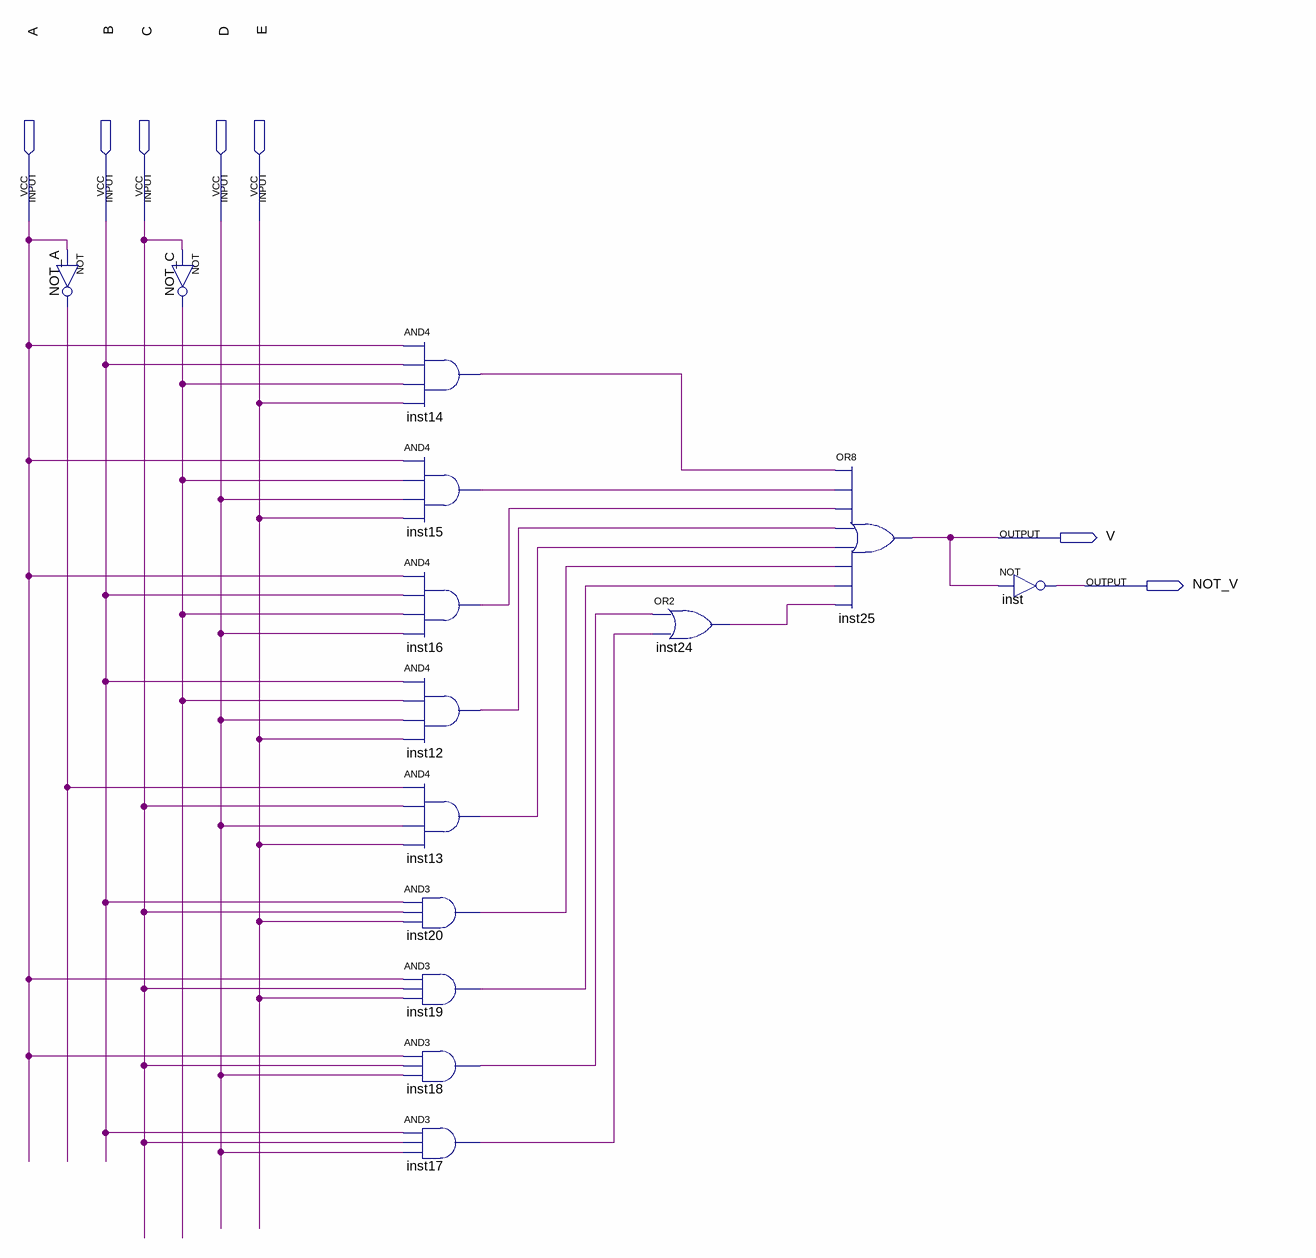
[diagram p0: schematic sheet]
// Quartus schematic devoir1_c1.bdf as structural Verilog: 14 symbols, 7 pins
module devoir1_c1 (
  input  A,
  input  B,
  input  C,
  input  D,
  input  E,
  output V,
  output NOT_V
);

  wire inst12_out, inst13_out, inst14_out, inst15_out, inst16_out, inst17_out, inst18_out, inst19_out,
       inst20_out, inst24_out, NOT_A_out, NOT_C_out;

  not NOT_A (NOT_A_out, A);
  not NOT_C (NOT_C_out, C);
  and inst14 (inst14_out, A, B, NOT_C_out, E);
  and inst15 (inst15_out, A, NOT_C_out, D, E);
  and inst16 (inst16_out, A, B, NOT_C_out, D);
  and inst12 (inst12_out, B, NOT_C_out, D, E);
  and inst13 (inst13_out, NOT_A_out, C, D, E);
  and inst20 (inst20_out, B, C, E);
  and inst19 (inst19_out, A, C, E);
  and inst18 (inst18_out, A, C, D);
  and inst17 (inst17_out, B, C, D);
  or inst24 (inst24_out, inst18_out, inst17_out);
  or inst25 (V, inst14_out, inst15_out, inst16_out, inst12_out, inst13_out, inst20_out, inst19_out, inst24_out);
  not inst (NOT_V, V);
endmodule
